# EAGLE design RetroESP32.shim (EAGLE 9.6.2)
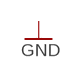
[diagram p0: schematic, sheet 1]

## Library data of the parts

## Board
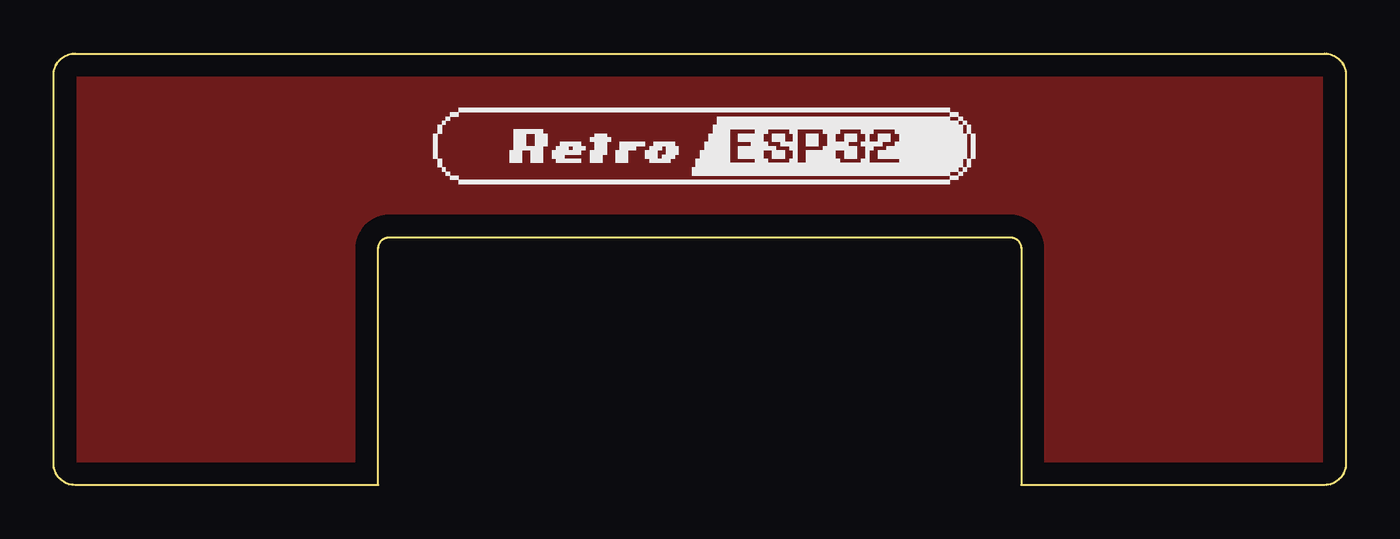
[diagram p1: board, top side]
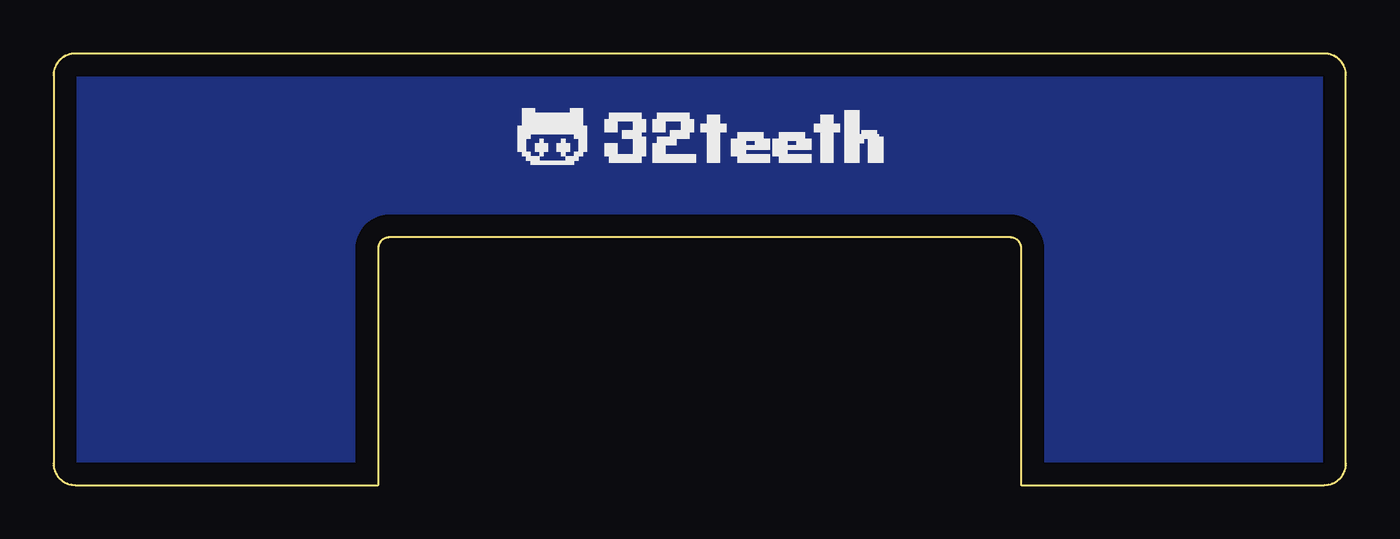
[diagram p2: board, bottom side, seen from below]

Size 60.3 x 20.13 mm. Coordinates in mm from the lower left corner, seen from the top.
Outline: 15.15,0 15.15,11.05 arc-90 15.65,11.55 44.65,11.55 arc-90 45.15,11.05 45.15,0 59.3,0 arc90 60.3,1 60.3,19.13 arc90 59.3,20.13 1,20.13 arc90 0,19.13 0,1 arc90 1,0 15.15,0
Copper layers (1*16): Top 0.035mm / dielectric 1.5mm / Bottom 0.035mm
Design rules "default": minimum track width 6mil, minimum drill 0.35mm, track to track 6mil, track to pad 6mil, pad to pad 6mil, via to via 6mil, smd to smd 6mil, copper to edge 40mil, drill to drill 6mil, minimum pad ring 10mil, minimum via ring 8mil, stop-mask expansion 4mil, vias tented up to drill 0mil, thermal gap 10mil

### Placement (x,y rotation side)
E$1  [RETROESP32]  17.65,17.55 0 top
U$1  GITHUB  [GITHUB]  38.65,17.55 0 bottom

### Tracks (layer width: path | path; a pad name or v marks a point on that pad's centre or on a via)
GND
  pour Bottom (no thermals): 0,20.13 0,0 15.15,0 15.15,11.55 45.15,11.55 45.15,0 60.3,0 60.3,20.13
  pour Top (no thermals): 0,20.13 60.3,20.13 60.3,0 45.15,0 45.15,11.55 15.15,11.55 15.15,0 0,0